# EAGLE design peltier_regulator (EAGLE 6.3)
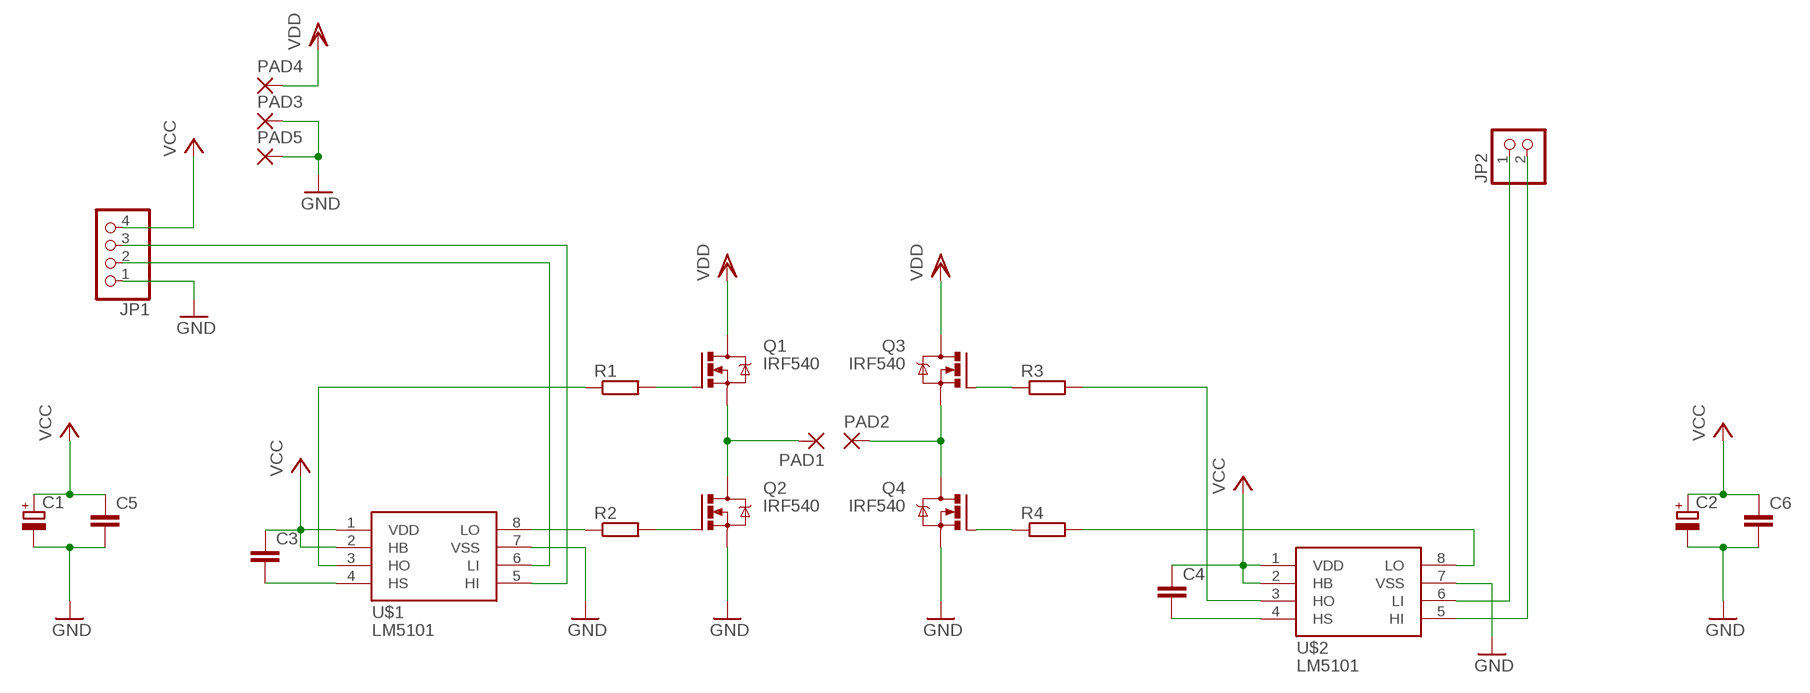
[diagram p0: schematic, sheet 1]

## Parts
C1  CPOL-EUD  [PANASONIC_D]
C2  CPOL-EUD  [PANASONIC_D]
C3  C-EUC1206  [C1206]
C4  C-EUC1206  [C1206]
C5  C-EUC1206  [C1206]
C6  C-EUC1206  [C1206]
JP1  PINHD-1X4  [1X04]
JP2  PINHD-1X2  [1X02]
PAD1  2,54/1,0  [2,54/1,0]
PAD2  2,54/1,0  [2,54/1,0]
PAD3  2,54/1,0  [2,54/1,0]
PAD4  2,54/1,0  [2,54/1,0]
PAD5  2,54/1,0  [2,54/1,0]
Q1  IRF540  [TO220BV]
Q2  IRF540  [TO220BV]
Q3  IRF540  [TO220BV]
Q4  IRF540  [TO220BV]
R1  R-EU_R1206  [R1206]
R2  R-EU_R1206  [R1206]
R3  R-EU_R1206  [R1206]
R4  R-EU_R1206  [R1206]
U$1  LM5101  [SOIC8]
U$2  LM5101  [SOIC8]

## Nets
GND: C1.- C2.- C5.2 C6.2 JP1.1 PAD3.1(P) PAD5.1(P) Q2.S Q4.S U$1.7(VSS) U$2.7(VSS)
N$1: C3.2 U$1.4(HS)
N$2: Q1.G R1.2
N$3: R2.1 U$1.8(LO)
N$4: Q2.G R2.2
N$5: R1.1 U$1.3(HO)
N$6: JP1.2 U$1.6(LI)
N$7: JP1.3 U$1.5(HI)
N$8: Q4.G R4.1
N$9: Q3.G R3.1
N$10: C4.2 U$2.4(HS)
N$11: R3.2 U$2.3(HO)
N$12: R4.2 U$2.8(LO)
N$13: JP2.1 U$2.6(LI)
N$14: JP2.2 U$2.5(HI)
N$15: PAD1.1(P) Q1.S Q2.D
N$16: PAD2.1(P) Q3.S Q4.D
VCC: C1.+ C2.+ C3.1 C4.1 C5.1 C6.1 JP1.4 U$1.1(VDD) U$1.2(HB) U$2.1(VDD) U$2.2(HB)
VDD: PAD4.1(P) Q1.D Q3.D

## Library data of the parts
C1 C2 = resistor:CPOL-EU: POLARIZED CAPACITOR, European symbol
C3-C6 = resistor:C-EU: CAPACITOR, European symbol
JP1 = pinhead:PINHD-1X4: PIN HEADER
JP2 = pinhead:PINHD-1X2: PIN HEADER
PAD1-PAD5 = wirepad:2,54/1,0: THROUGH-HOLE PAD
Q1-Q4 = transistor-power:IRF540: HEXFET Power MOSFET
R1-R4 = resistor:R-EU_: RESISTOR, European symbol
U$1 U$2 = lm5101:LM5101

## Board
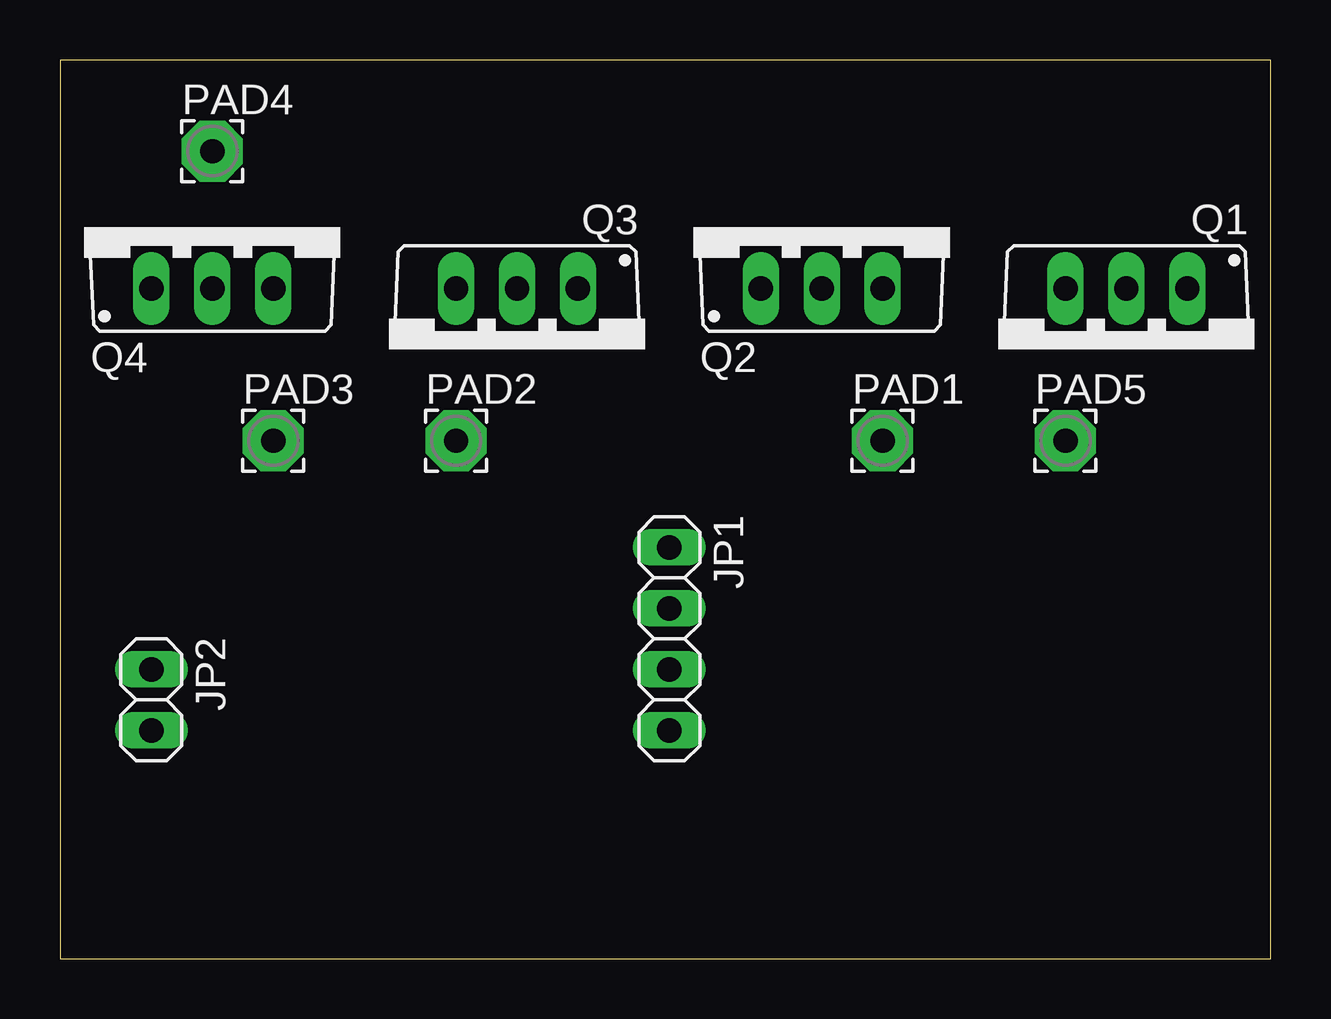
[diagram p1: board, top side]
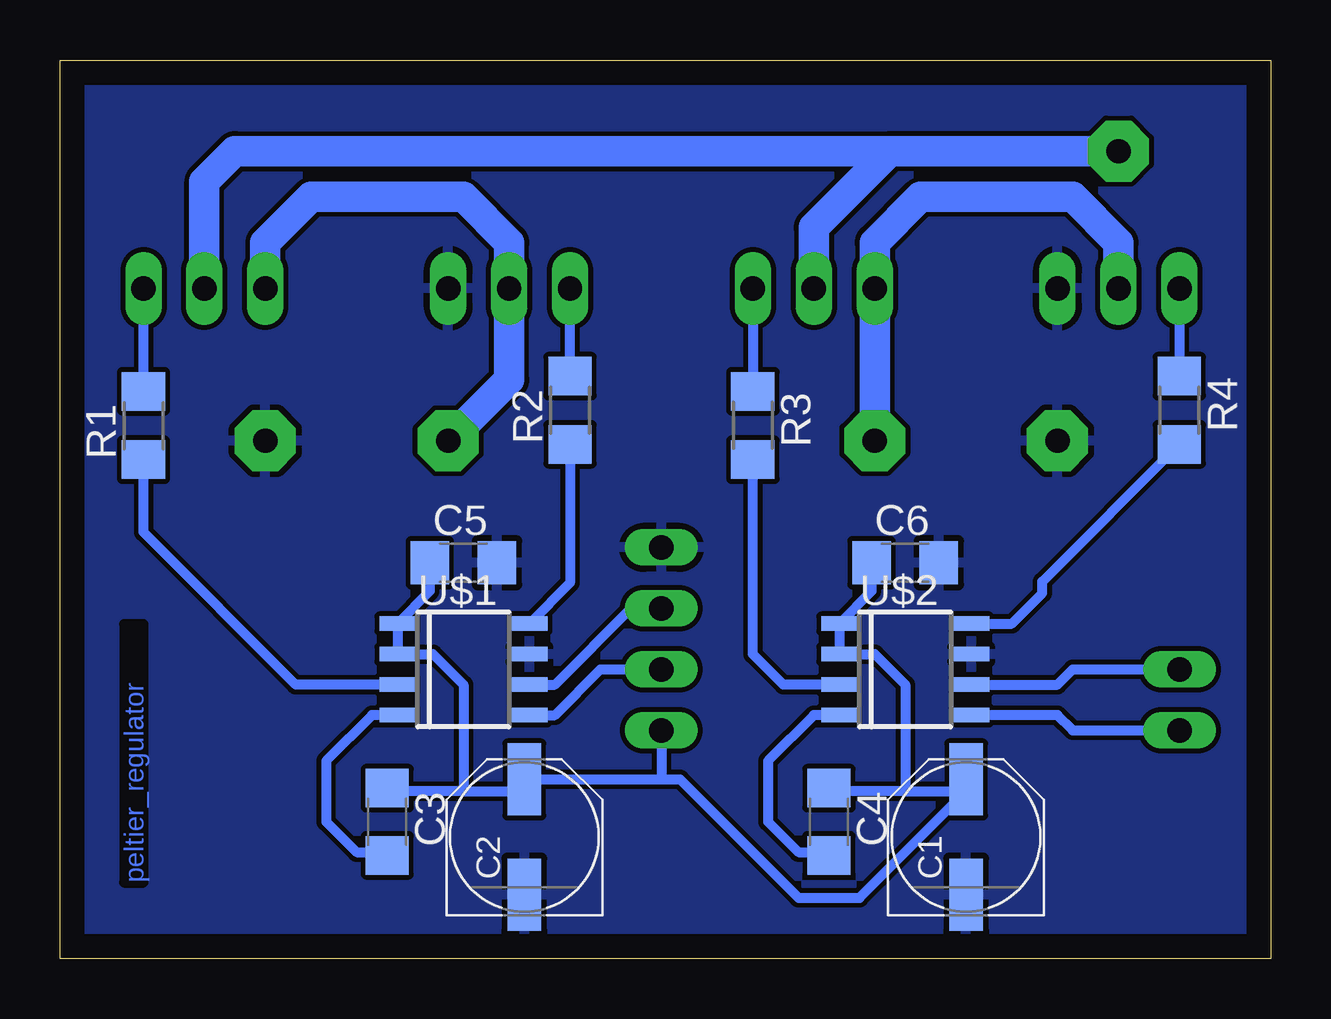
[diagram p2: board, bottom side, seen from below]

Size 50.47 x 37.45 mm. Coordinates in mm from the lower left corner, seen from the top.
Outline: 0,0 50.47,0 50.47,37.45 0,37.45 0,0
Copper layers (1*16): Top 0.035mm / dielectric 1.5mm / Bottom 0.035mm
Design rules "default": minimum track width 10mil, minimum drill 24mil, track to track 8mil, track to pad 8mil, pad to pad 8mil, via to via 8mil, smd to smd 8mil, copper to edge 40mil, drill to drill 8mil, minimum pad ring 10mil, minimum via ring 8mil, stop-mask expansion 4mil, vias tented up to drill 0mil, thermal gap 10mil

### Footprints (pad centres in the part's own frame; a part is rotated, then mirrored left to right if it is on the bottom)
PANASONIC_D = smd 3 x 1.4: + 2.4,0; - -2.4,0
C1206 = smd 1.6 x 1.8: 1 -1.4,0; 2 1.4,0
1X04 = drill 1.016 long: 1 -3.81,0; 2 -1.27,0; 3 1.27,0; 4 3.81,0
1X02 = drill 1.016 long: 1 -1.27,0; 2 1.27,0
2,54/1,0 = drill 1.016 pad 2.54 octagon: 1 0,0
TO220BV = drill 1.016 long: D 0,-2.54; G -2.54,-2.54; S 2.54,-2.54
R1206 = smd 1.6 x 1.803: 1 -1.422,0; 2 1.422,0
SOIC8 = smd 0.6 x 1.5: 1 -1.905,-2.75; 2 -0.635,-2.75; 3 0.635,-2.75; 4 1.905,-2.75; 5 1.905,2.75; 6 0.635,2.75; 7 -0.635,2.75; 8 -1.905,2.75

### Placement (x,y rotation side)
C1  12.7,5.08 90 bottom
C2  31.11,5.08 90 bottom
C3  36.83,5.71 270 bottom
C4  18.41,5.71 270 bottom
C5  33.66,16.51 0 bottom
C6  15.24,16.51 0 bottom
JP1  25.4,13.34 270 top
JP2  3.81,10.79 270 top
PAD1  34.29,21.59 0 top
PAD2  16.51,21.59 0 top
PAD3  8.89,21.59 0 top
PAD4  6.35,33.66 0 top
PAD5  41.91,21.59 0 top
Q1  44.45,25.4 180 top
Q2  31.75,30.48 0 top
Q3  19.05,25.4 180 top
Q4  6.35,30.48 0 top
R1  46.99,22.23 90 bottom
R2  29.21,22.86 90 bottom
R3  21.59,22.23 270 bottom
R4  3.81,22.86 270 bottom
U$1  33.66,12.06 270 bottom
U$2  15.24,12.06 270 bottom

### Tracks (layer width: path | path; a pad name or v marks a point on that pad's centre or on a via)
GND
  pour Bottom: 0,37.47 50.16,37.47 50.16,0 0,0
N$1
  Bottom 0.406: U$1.4 37.47,10.16 39.37,8.26 39.37,5.71 38.1,4.45 36.96,4.45 C3.2
N$2
  Bottom 0.406: R1.2 Q1.G
N$3
  Bottom 0.406: R2.1 29.21,15.66 U$1.8
N$4
  Bottom 0.406: R2.2 Q2.G
N$5
  Bottom 0.406: U$1.3 40.64,11.43 46.99,17.78 R1.1
N$6
  Bottom 0.406: U$1.6 29.84,11.43 26.67,14.61 JP1.2
N$7
  Bottom 0.406: U$1.5 29.84,10.16 27.94,12.06 JP1.3
N$8
  Bottom 0.406: Q4.G R4.1
N$9
  Bottom 0.406: Q3.G R3.1
N$10
  Bottom 0.406: U$2.4 19.05,10.16 20.95,8.26 20.95,5.71 19.68,4.45 18.55,4.45 C4.2
N$11
  Bottom 0.406: U$2.3 20.32,11.43 21.59,12.7 R3.2
N$12
  Bottom 0.406: U$2.8 10.79,13.97 9.53,15.24 9.53,15.72 R4.2
N$13
  Bottom 0.406: U$2.6 8.89,11.43 8.26,12.06 JP2.1
N$14
  Bottom 0.406: U$2.5 8.89,10.16 8.26,9.53 JP2.2
N$15
  Bottom 1.27: Q1.S 41.91,29.84 40.01,31.75 33.66,31.75 31.75,29.84 Q2.D 31.75,24.13 PAD1.1
N$16
  Bottom 1.27: Q4.D 6.35,29.84 8.26,31.75 14.61,31.75 16.51,29.84 Q3.S PAD2.1
VCC
  Bottom 0.406: C6.1 16.64,15.32 U$2.1 U$2.2 16.51,12.7 15.24,11.43 15.24,6.99 | C5.1 35.05,15.32 U$1.1 U$1.2 34.92,12.7 33.66,11.43 33.66,6.99 | 15.24,6.99 18.29,6.99 C4.1 | 15.24,6.99 13.2,6.99 C1.+ | 33.66,6.99 36.7,6.99 C3.1 | 33.66,6.99 31.61,6.99 C2.+ 25.4,7.48 | 12.21,6.99 C1.+ | 25.4,7.48 24.62,7.48 19.68,2.54 17.14,2.54 12.7,6.99 C1.+ | JP1.4 25.4,7.48
VDD
  Bottom 1.27: PAD4.1 15.88,33.66 | 15.88,33.66 19.05,30.48 Q3.D | Q1.D 44.45,32.38 43.18,33.66 15.88,33.66

### Text on the board
Bottom: peltier_regulator